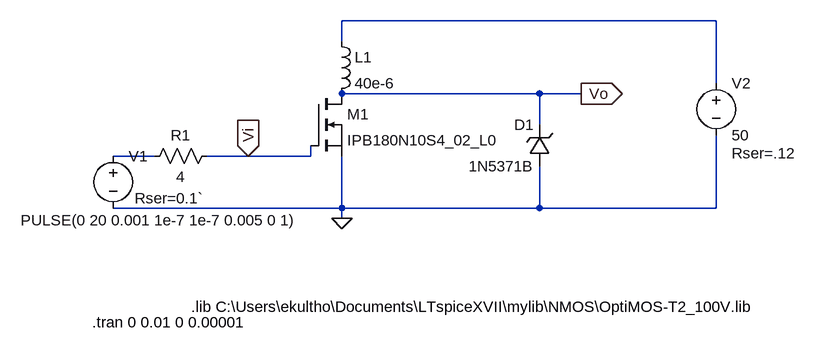
[diagram p0: schematic 60V Zener Diode Config.asc]
60V Zener Diode Config.asc, the LTspice schematic file:
Version 4
SHEET 1 916 680
WIRE 688 -16 112 -16
WIRE 112 16 112 -16
WIRE 688 80 688 -16
WIRE 416 96 112 96
WIRE 480 96 416 96
WIRE 416 144 416 96
WIRE -176 192 -240 192
WIRE -32 192 -96 192
WIRE 64 192 64 176
WIRE 64 192 -32 192
WIRE 112 272 112 192
WIRE 112 272 -240 272
WIRE 416 272 416 208
WIRE 416 272 112 272
WIRE 688 272 688 160
WIRE 688 272 416 272
WIRE 112 288 112 272
FLAG 112 288 0
FLAG 480 96 Vo
IOPIN 480 96 Out
FLAG -32 192 Vi
IOPIN -32 192 In
SYMBOL nmos 64 96 R0
SYMATTR InstName M1
SYMATTR Value IPB180N10S4_02_L0
SYMATTR Prefix X
SYMBOL voltage -240 176 R0
WINDOW 3 -142 115 Left 2
WINDOW 123 24 124 Left 2
WINDOW 39 33 81 Left 2
SYMATTR Value PULSE(0 20 0.001 1e-7 1e-7 0.005 0 1)
SYMATTR SpiceLine Rser=0.1`
SYMATTR InstName V1
SYMBOL voltage 688 64 R0
WINDOW 123 0 0 Left 0
WINDOW 39 24 124 Left 2
SYMATTR SpiceLine Rser=.12
SYMATTR InstName V2
SYMATTR Value 50
SYMBOL ind 96 0 R0
SYMATTR InstName L1
SYMATTR Value 40e-6
SYMATTR SpiceLine Rser=.2 Cpar=1e-9
SYMBOL res -80 176 R90
WINDOW 0 0 56 VBottom 2
WINDOW 3 32 56 VTop 2
SYMATTR InstName R1
SYMATTR Value 4
SYMBOL zener 432 208 R180
WINDOW 0 24 64 Left 2
WINDOW 3 24 0 Left 2
SYMATTR InstName D1
SYMATTR Value 1N5371B
SYMATTR Description Diode
SYMATTR Type diode
TEXT -120 424 Left 2 !.lib C:\\Users\\ekultho\\Documents\\LTspiceXVII\\mylib\\NMOS\\OptiMOS-T2_100V.lib
TEXT -272 448 Left 2 !.tran 0 0.01 0 0.00001

The netlist it stands for:
* 60V Zener Diode Config.asc
XM1 Vo Vi 0 IPB180N10S4_02_L0  ; pins D G S
V1 N002 0 PULSE(0 20 0.001 1e-7 1e-7 0.005 0 1) Rser=0.1`
V2 N001 0 50 Rser=.12
L1 N001 Vo 40e-6 Rser=.2 Cpar=1e-9
R1 Vi N002 4
D1 0 Vo 1N5371B
.model D D
.lib standard.dio
.lib C:\Users\ekultho\Documents\LTspiceXVII\mylib\NMOS\OptiMOS-T2_100V.lib
.tran 0 0.01 0 0.00001
.backanno
.end

* Results of the author's LTspice run, read from the files saved beside the schematic
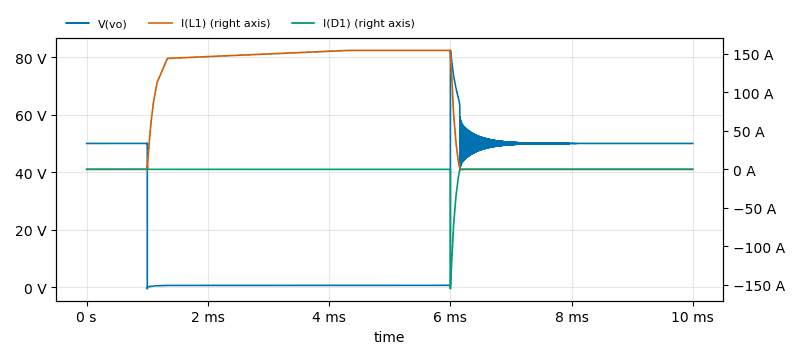
[diagram p1: Transient Analysis of 60V Zener Diode Config.asc, plotted from the saved traces]
* Transient Analysis, 1 run:
*   V(vo): min -648.3 mV, max 82.47 V, average 25.62 V, rms 35.94 V, last 50 V
*   I(L1): min -351.3 mA, max 154.4 A, average 76.13 A, rms 107.4 A, last 0 A
*   I(D1): min -155.6 A, max 8.922 mA, average -884 mA, rms 9.002 A, last 0 A